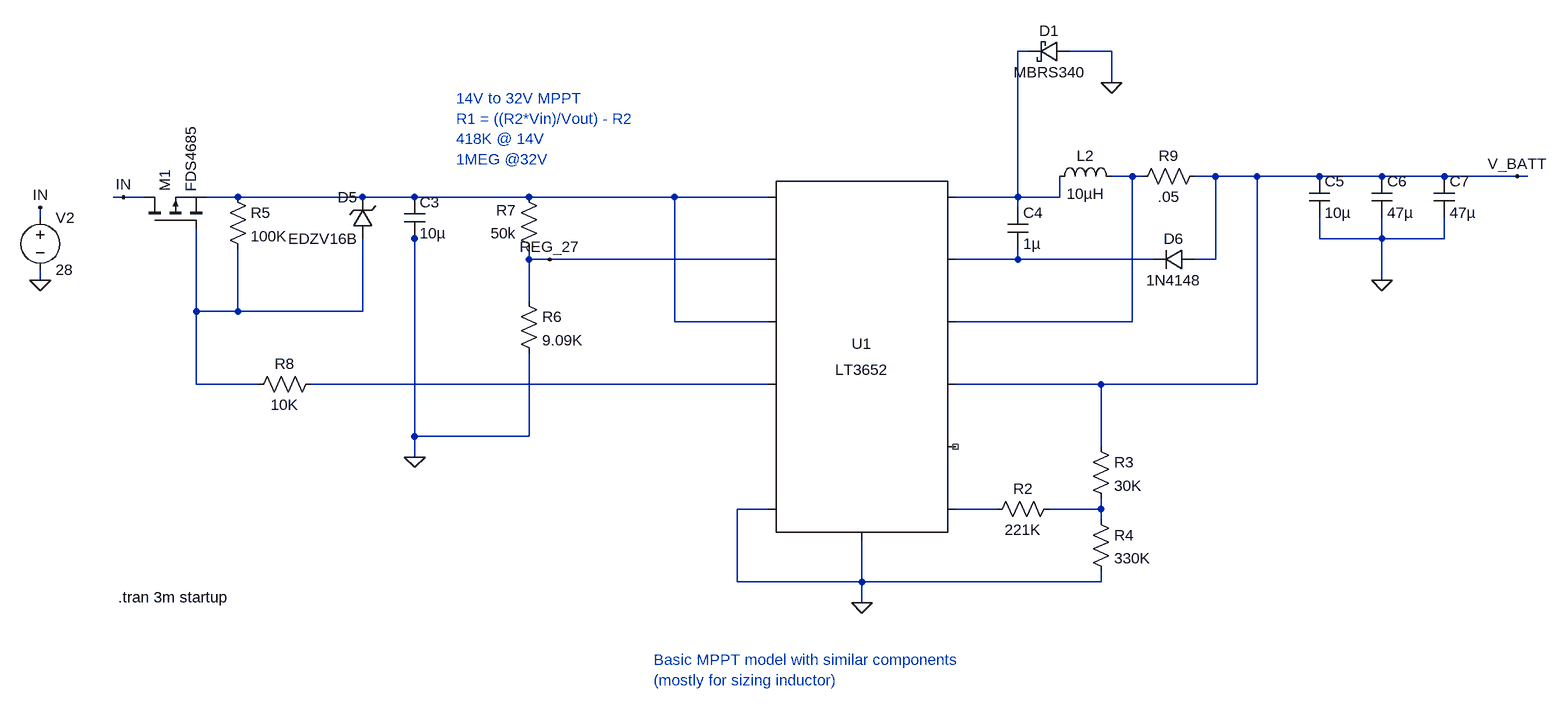
[diagram p0: schematic Solar_MPPT.asc]
Solar_MPPT.asc, the LTspice schematic file:
Version 4
SHEET 1 1436 832
WIRE 624 -224 608 -224
WIRE 752 -224 688 -224
WIRE 752 -176 752 -224
WIRE 784 -32 752 -32
WIRE 800 -32 784 -32
WIRE 912 -32 880 -32
WIRE 976 -32 912 -32
WIRE 1072 -32 976 -32
WIRE 1168 -32 1072 -32
WIRE 1264 -32 1168 -32
WIRE 1376 -32 1264 -32
WIRE 1392 -32 1376 -32
WIRE -768 0 -784 0
WIRE -736 0 -768 0
WIRE -592 0 -640 0
WIRE -400 0 -592 0
WIRE -320 0 -400 0
WIRE -144 0 -320 0
WIRE 80 0 -144 0
WIRE 224 0 80 0
WIRE 608 0 608 -224
WIRE 608 0 512 0
WIRE 672 0 672 -32
WIRE 672 0 608 0
WIRE 608 16 608 0
WIRE -896 32 -896 16
WIRE -320 64 -320 48
WIRE 1072 64 1072 32
WIRE 1168 64 1168 32
WIRE 1168 64 1072 64
WIRE 1264 64 1264 32
WIRE 1264 64 1168 64
WIRE -144 96 -144 80
WIRE -112 96 -144 96
WIRE 224 96 -112 96
WIRE 608 96 608 80
WIRE 608 96 512 96
WIRE 816 96 608 96
WIRE 912 96 912 -32
WIRE 912 96 880 96
WIRE -896 128 -896 112
WIRE 1168 128 1168 64
WIRE -144 160 -144 96
WIRE -656 176 -656 48
WIRE -592 176 -592 80
WIRE -592 176 -656 176
WIRE -400 176 -400 64
WIRE -400 176 -592 176
WIRE 80 192 80 0
WIRE 224 192 80 192
WIRE 784 192 784 -32
WIRE 784 192 512 192
WIRE -656 288 -656 176
WIRE -560 288 -656 288
WIRE 224 288 -480 288
WIRE 736 288 512 288
WIRE 976 288 976 -32
WIRE 976 288 736 288
WIRE -320 368 -320 64
WIRE -144 368 -144 240
WIRE -144 368 -320 368
WIRE 736 384 736 288
WIRE -320 400 -320 368
WIRE 224 480 176 480
WIRE 576 480 512 480
WIRE 736 480 736 464
WIRE 736 480 656 480
WIRE 736 496 736 480
WIRE 176 592 176 480
WIRE 368 592 368 528
WIRE 368 592 176 592
WIRE 736 592 736 576
WIRE 736 592 368 592
WIRE 368 624 368 592
FLAG 368 624 0
FLAG -896 128 0
FLAG -896 16 IN
FLAG -768 0 IN
FLAG -320 400 0
FLAG 752 -176 0
FLAG 1168 128 0
FLAG 1376 -32 V_BATT
FLAG -112 96 REG_27
SYMBOL PowerProducts/LT3652 368 240 R0
SYMATTR InstName U1
SYMBOL schottky 688 -240 R90
WINDOW 3 32 32 VTop 2
WINDOW 0 0 32 VBottom 2
SYMATTR Value MBRS340
SYMATTR InstName D1
SYMATTR Description Diode
SYMATTR Type diode
SYMBOL res 560 496 R270
WINDOW 0 32 56 VTop 2
WINDOW 3 0 56 VBottom 2
SYMATTR InstName R2
SYMATTR Value 221K
SYMBOL res 720 368 R0
SYMATTR InstName R3
SYMATTR Value 30K
SYMBOL res 720 480 R0
SYMATTR InstName R4
SYMATTR Value 330K
SYMBOL res -608 -16 R0
SYMATTR InstName R5
SYMATTR Value 100K
SYMBOL res -160 144 R0
SYMATTR InstName R6
SYMATTR Value 9.09K
SYMBOL res -128 96 R180
WINDOW 0 36 76 Left 2
WINDOW 3 36 40 Left 2
SYMATTR InstName R7
SYMATTR Value 50k
SYMBOL res -576 304 R270
WINDOW 0 32 56 VTop 2
WINDOW 3 0 56 VBottom 2
SYMATTR InstName R8
SYMATTR Value 10K
SYMBOL cap -336 0 R0
SYMATTR InstName C3
SYMATTR Value 10µ
SYMBOL voltage -896 16 R0
SYMATTR InstName V2
SYMATTR Value 28
SYMBOL zener -384 64 R180
WINDOW 0 24 64 Left 2
WINDOW 3 24 0 Left 2
SYMATTR InstName D5
SYMATTR Value EDZV16B
SYMBOL ind 656 -16 R270
WINDOW 0 32 56 VTop 2
WINDOW 3 5 56 VBottom 2
SYMATTR InstName L2
SYMATTR Value 10µH
SYMATTR SpiceLine Rpar=10K
SYMBOL res 784 -16 R270
WINDOW 0 32 56 VTop 2
WINDOW 3 0 56 VBottom 2
SYMATTR InstName R9
SYMATTR Value .05
SYMBOL cap 592 16 R0
SYMATTR InstName C4
SYMATTR Value 1µ
SYMBOL diode 880 80 R90
WINDOW 0 0 32 VBottom 2
WINDOW 3 32 32 VTop 2
SYMATTR InstName D6
SYMATTR Value 1N4148
SYMATTR Description Zener Diode
SYMATTR Type zener
SYMBOL cap 1056 -32 R0
SYMATTR InstName C5
SYMATTR Value 10µ
SYMBOL cap 1152 -32 R0
SYMATTR InstName C6
SYMATTR Value 47µ
SYMBOL cap 1248 -32 R0
SYMATTR InstName C7
SYMATTR Value 47µ
SYMBOL pmos -736 48 R270
SYMATTR InstName M1
SYMATTR Value FDS4685
TEXT -776 616 Left 2 !.tran 3m startup
TEXT -256 -152 Left 2 ;14V to 32V MPPT\nR1 = ((R2*Vin)/Vout) - R2\n418K @ 14V\n1MEG @32V
TEXT 48 712 Left 2 ;Basic MPPT model with similar components\n(mostly for sizing inductor)

The netlist it stands for:
* Solar_MPPT.asc
XU1 N003 REG_27 N003 N006 NC_01 0 N007 NC_02 V_BATT N002 N004 N001 0 LT3652
D1 0 N001 MBRS340
R2 N007 N008 221K
R3 V_BATT N008 30K
R4 N008 0 330K
R5 N003 N005 100K
R6 REG_27 0 9.09K
R7 REG_27 N003 50k
R8 N005 N006 10K
C3 N003 0 10µ
V2 IN 0 28
D5 N005 N003 EDZV16B
L2 N001 N002 10µH Rpar=10K
R9 N002 V_BATT .05
C4 N001 N004 1µ
D6 V_BATT N004 1N4148
C5 V_BATT 0 10µ
C6 V_BATT 0 47µ
C7 V_BATT 0 47µ
M1 IN N005 N003 N003 FDS4685
.model D D
.lib standard.dio
.model NMOS NMOS
.model PMOS PMOS
.lib standard.mos
.tran 3m startup
* 14V to 32V MPPT
* R1 = ((R2*Vin)/Vout) - R2
* 418K @ 14V
* 1MEG @32V
* Basic MPPT model with similar components
* (mostly for sizing inductor)
.lib LT3652.sub
.backanno
.end